# Altium schematic sheet LevelShifter.SchDoc
size A; SheetNumber: 6; SheetTotal: 8
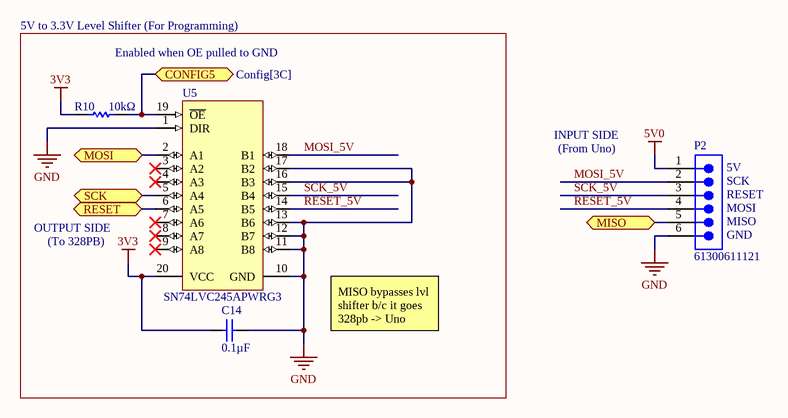
[diagram p0: LevelShifter.SchDoc]

## Parts
C14  0.1µF  [CAPC3216X100X50LL20T25]
P2  61300611121  [61300611121]
R10  10kΩ  [RESC3116X65X40LL10T20]
U5  SN74LVC245APWRG3  [PW0020A_N]

## Ports
CONFIG5 (bidir, see Config[3C]), MISO (bidir, see Microcontroller[3C], MicroSD[3B]), MOSI (bidir, see Microcontroller[3C], MicroSD[3B]), RESET (bidir, see Microcontroller[3B]), SCK (bidir, see Microcontroller[3C], MicroSD[3B])

## Nets
3V3: C14.1 R10.2 U5.20(VCC)
5V0: P2.1
GND: C14.2 P2.6 U5.1(DIR) U5.10(GND) U5.11(B8) U5.12(B7) U5.13(B6) U5.16(B3) U5.17(B2)
CONFIG5: R10.1 U5.19(~{OE}) ; port CONFIG5
MISO: P2.5 ; port MISO
MOSI: U5.2(A1) ; port MOSI
MOSI_5V: P2.2 U5.18(B1)
RESET: U5.6(A5) ; port RESET
RESET_5V: P2.4 U5.14(B5)
SCK: U5.5(A4) ; port SCK
SCK_5V: P2.3 U5.15(B4)

Not connected (* = marked no-connect by the designer): U5 3(A2)* 4(A3)* 7(A6)* 8(A7)* 9(A8)*

## Notes on the sheet
- 5V to 3.3V Level Shifter (For Programming)
- Enabled when OE pulled to GND
- INPUT SIDE
- (From Uno)
- (near P2) 5V
- (near P2) SCK
- OUTPUT SIDE
- (To 328PB)
- (near P2) MISO
- (near P2) GND
- (near P2) MOSI
- (near P2) RESET
- MISO bypasses lvl shifter b/c it goes 328pb -> Uno

## Library data of the parts
C14 = CMP-1664-00001-4: Chip Capacitor, 100 nF, +/- 10%, 25 V, -55 to 125 degC, 1206 (3216 Metric), RoHS, Tape and Reel; Manufacturer: Kemet; Voltage Rating: 25 V; ComponentLink1URL: http://www.kemet.com/; Max Operating Temperature: 125 degC; PackageReference: 1206; ComponentLink2URL: http://www.kemet.com/docfinder?Partnumber=C1206F104K3RACTU; ComponentLink1Description: Manufacturer URL; ComponentLink2Description: Datasheet; Length: 3.2 mm; Packaging: Tape and Reel; Height: 0.78 mm; Mounting Technology: Surface Mount; REACH SVHC: No SVHC; PackageDescription: 2-Pin Surface Mount Device, Body 3.2 x 1.6 mm; Min Operating Temperature: -55 degC; RoHSCompliant: true; DatasheetVersion: 02/2016; Package Quantity: 4000
P2 = CMP-1502-01070-3: NexarPartId: 20084590; Current Rating: 3A; Pitch: 2.54mm; Gender: Male; Operating Supply Voltage: 250V; Connector Type: Male Pin; Number of Positions: 6; Contact Resistance: 20mΩ; Packaging: Bulk; Number of Pins: 6; Number of Rows: 1; Contact Plating: Gold; Lead Free: Lead Free; RoHS: Compliant; Contact Mating Length: 5.9944mm; Voltage Rating: 250V; REACH SVHC: Unknown; Contact Gender: Male; Housing Material: PBT; Min Operating Temperature: -40°C; Lead Pitch: 2.54mm; Mount: Through Hole; Number of Contacts: 6; Max Operating Temperature: 105°C; Contact Material: Copper; Orientation: Vertical; Termination: Through Hole; Color: Black; Height: 8.89mm
R10 = CMP-1014-00623-2: Chip Resistor, 10 KOhm, +/- 1%, 0.25 W, -55 to 155 degC, 1206 (3216 Metric), RoHS, Tape and Reel; Manufacturer: Yageo; Voltage Rating: 200V; Resistance: 10KOhm; Temperature Coefficient: 100ppm/degreesC; Power Rating: 250mW; Packaging: TapeandReel; Termination: SMD/SMT; REACH SVHC: Unknown; Tolerance: 1%; Height: 0.55mm; Composition: ThickFilm; Max Operating Temperature: 155degC; Datasheet Version: Rev. 5, 10/2016; Lead Free: LeadFree; Case Code (Metric): 3216; Depth: 1.6mm; Package Quantity: 5000; RoHSCompliant: true; Military Standard: Not; Case/Package: 1206; Case Code (Imperial): 1206; Min Operating Temperature: -55degC; Datasheet URL: http://www.yageo.com/NewPortal/yageodocoutput?fileName=/pdf/R-Chip/PYu-RC_Group_51_RoHS_L_5.pdf; Length: 3.1mm; Manufacturer URL: http://www.yageo.com/; Package Reference: 1206.0; Width: 1.6mm; Package Description: 2-Pin Surface Mount Device, Body 3.1 x 1.6 mm
U5 = CMP-1620-00520-2: Octal Bus Transceiver With 3-State Outputs, PW0020A, LARGE T&R; Manufacturer: Texas Instruments; Input Type: TTL/CMOS; tpd @ Nom Voltage(Max)(ns): 12.7,8.3,7.3,6.3; Output Type: LVTTL; Bits(#): 8; VCC(Max)(V): 3.6; F @ Nom Voltage(Max)(Mhz): 100; Output Drive (IOL/IOH)(Max)(mA): -24/24; Rating: Catalog; Schmitt Trigger: No; ICC @ Nom Voltage(Max)(mA): 0.03; VCC(Min)(V): 1.65; Voltage(Nom)(V): 1.8,2.5,2.7,3.3; Technology Family: LVC; DatasheetVersion: SCAS218X; PackageReference: PW0020A; Generic Part Number: SN74LVC245A; Code_JEDEC: MO-153; Operating Temperature Range(C): -40 to 125